# Altium schematic sheet ESenseFE-FilterBank1.SchDoc (part 2 of 2)
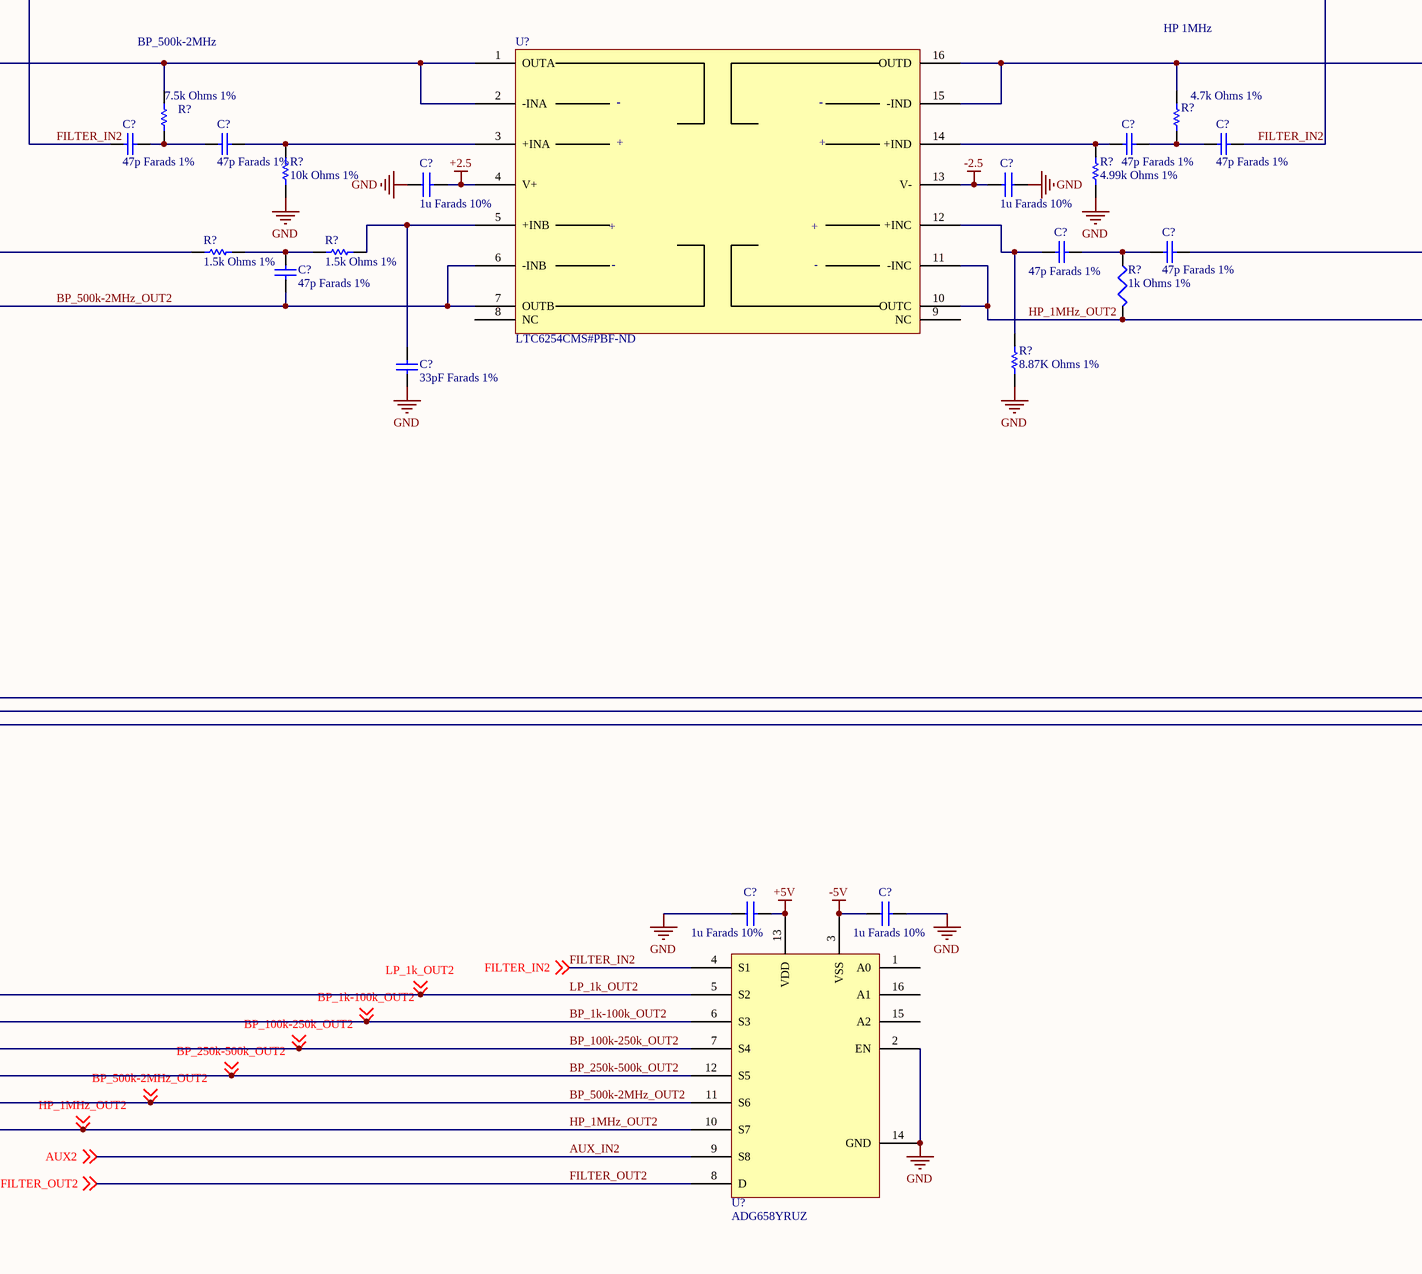
[diagram p4: ESenseFE-FilterBank1.SchDoc, bottom right]

## Library data of the parts
C?#1-C?#7 C?#10 C?#13 C?#15 = 2205: capacitor ceramic 1000pf, 50v, c0g, 0603; dielectric; mfrName: AVX; mfrPartNum: 06035A102FAT2A; Label: 1uF; Extra_Description: CAPACITOR CERAMIC 1000PF, 50V, C0G, 0603; Dielectric Characteristic:C0G/NP0; Capacitance:1000pF; Capacitance Tolerance:± 1%; Voltage Rating:50V; Temperature Coefficient:0 ± 30ppm/°C; Capacitor Case Style:0603; No. of Pins:2 ;RoHS Compliant: Yes / Packaging: ``Tape`` / RoHS: ``Compliant`` / Voltage Rating (DC): { / ``uncertainty_minus``: null, / ``value``: 50.0, / ``uncertainty_plus``: null / } / Capacitance: { / ``uncertainty_minus``: null, / ``value``: 1E-09, / ``uncertainty_plus``: null / } / Capacitance Tolerance: { / ``max_value``: 1.0, / ``max_uncertainty_plus``: null, / ``min_value``: -1.0, / ``min_uncertainty_plus``: null, / ``max_uncertainty_minus``: null / } / Number of Pins: 2; Obsolete: False; Temp_Max: 0; Type: All Parts; TypeNotes: Applies to all parts in the database; PartID: 2205; URL_Image: http://cdn.sigma.octopart.com/8893021/image/AVX-06035A102FAT2A.jpg; URL_Datasheet: http://datasheet.octopart.com/06035A102FAT2A-AVX-datasheet-8446347.pdf; Date_Created: 5/8/2011 9:06:39 AM; Date_LastModified: 5/8/2011 9:06:39 AM; Verified: False; RoHS: True; Temp_Min: 0
C?#8 C?#9 C?#11 C?#12 C?#29-C?#32 C?#49-C?#52 C?#61-C?#64 = 2065: CAP CER 1.0UF 10V 10% X5R 0603; mfrName: Murata Electronics North America; mfrPartNum: GRM188R61A105KA61D; Extra_Description: Datasheets	Chip Monolithic Ceramic Caps Part Numbering / GRM Series Spec/Test Methods (1) / GRM188R61A105KA61 / Product Photos	0603 Murata MLCC Caps / Product Training Modules	High-Cap Multilayer Ceramic Capacitors / Catalog Drawings	GRM Series Top, Sides / Standard Package	10 / Category	Capacitors / Family	Ceramic / Series	GRM / Capacitance	1.0µF / Voltage - Rated	10V / Tolerance	±10% / Temperature Coefficient	X5R / Mounting Type	Surface Mount, MLCC / Operating Temperature	-55°C ~ 85°C / Features	- / Applications	General Purpose / Ratings	- / Package / Case	0603 (1608 Metric) / Size / Dimension	0.063`` L x 0.032`` W (1.60mm x 0.80mm) / Lead Spacing	- / Thickness	0.80mm / Packaging	Cut Tape (CT) / Lead Style	- / Catalog Page	1886 (US2010 Interactive) / 1886 (US2010 PDF) / Other Names	490-1543-1; Obsolete: False; Temp_Max: 0; Type: Ceramic; PartID: 2065; URL_Image: HTTP://MEDIA.DIGIKEY.COM/PHOTOS/MURATA%20PHOTOS/0603%20MURATA%20MLCC%20CAPS.JPG; URL_Datasheet: http://search.murata.co.jp/Ceramy/image/img/w_hinm/L0005E.pdf; Date_Created: 9/27/2010 4:47:48 PM; Date_LastModified: 9/27/2010 4:47:48 PM; Verified: False; RoHS: True; Temp_Min: 0
C?#14 C?#16 C?#21-C?#28 C?#33-C?#36 C?#41-C?#48 C?#53-C?#58 = 2216: ceramic multilayer capacitor; capacitor type:general; mfrName: AVX; mfrPartNum: 06031A470FAT2A; Label: 1uF; Extra_Description: Ceramic Multilayer Capacitor; Capacitor Type:General Purpose; Capacitance:47pF; Capacitance Tolerance:± 1%; Voltage Rating:100VDC; Capacitor Dielectric Type:Multilayer Ceramic; Package/Case:0603; Termination Type:SMD ;RoHS Compliant: Yes / Mounting Type: ``Surface Mount`` / Lead-Free Status: ``Lead Free`` / Packaging: ``Cut Tape (CT)`` / RoHS: ``Compliant`` / Size-Width: { / ``uncertainty_minus``: null, / ``value``: 0.00081, / ``uncertainty_plus``: null / } / Size-Length: { / ``uncertainty_minus``: null, / ``value``: 0.0016, / ``uncertainty_plus``: null / } / Size-Height: { / ``uncertainty_minus``: null, / ``value``: 0.00086, / ``uncertainty_plus``: null / } / Voltage Rating (DC): { / ``uncertainty_minus``: null, / ``value``: 100.0, / ``uncertainty_plus``: null / } / Capacitance: { / ``uncertainty_minus``: null, / ``value``: 4.7E-11, / ``uncertainty_plus``: null / } / Capacitance Tolerance: { / ``max_value``: 1.0, / ``max_uncertainty_plus``: null, / ``min_value``: -1.0, / ``min_uncertainty_plus``: null, / ``max_uncertainty_minus``: null / } / Operating Temperature: { / ``max_value``: 125.0, / ``max_uncertainty_plus``: null, / ``min_value``: null, / ``min_uncertainty_plus``: null, / ``max_uncertainty_minus``: null / } / Number of Pins: 2; Obsolete: False; Temp_Max: 0; Type: All Parts; TypeNotes: Applies to all parts in the database; PartID: 2216; URL_Image: http://cdn.sigma.octopart.com/8893021/image/AVX-06031A470FAT2A.jpg; URL_Datasheet: http://datasheet.octopart.com/06031A470FAT2A-AVX-datasheet-118583.pdf; Date_Created: 5/9/2011 10:45:08 AM; Date_LastModified: 5/9/2011 10:45:08 AM; Verified: False; RoHS: True; Temp_Min: 0
C?#17 C?#19 = 2212: capacitor ceramic 330pf, 50v, c0g, 0603; dielectric; mfrName: AVX; mfrPartNum: 06035A331FAT2A; Label: 1uF; Extra_Description: CAPACITOR CERAMIC 330PF, 50V, C0G, 0603; Dielectric Characteristic:C0G/NP0; Capacitance:330pF; Capacitance Tolerance:± 1%; Voltage Rating:50V; Temperature Coefficient:0+/-30 ppm; Capacitor Case Style:0603; No. of Pins:2 ;RoHS Compliant: Yes / Packaging: ``Tape`` / RoHS: ``Compliant`` / Voltage Rating (DC): { / ``uncertainty_minus``: null, / ``value``: 50.0, / ``uncertainty_plus``: null / } / Capacitance: { / ``uncertainty_minus``: null, / ``value``: 3.3E-10, / ``uncertainty_plus``: null / } / Capacitance Tolerance: { / ``max_value``: 1.0, / ``max_uncertainty_plus``: null, / ``min_value``: -1.0, / ``min_uncertainty_plus``: null, / ``max_uncertainty_minus``: null / } / Number of Pins: 2; Obsolete: False; Temp_Max: 0; Type: All Parts; TypeNotes: Applies to all parts in the database; PartID: 2212; URL_Image: http://cdn.sigma.octopart.com/8893021/image/AVX-06035A331FAT2A.jpg; URL_Datasheet: http://www.avx.com/docs/Catalogs/ccog.pdf; Date_Created: 5/9/2011 10:22:55 AM; Date_LastModified: 5/9/2011 10:22:55 AM; Verified: False; RoHS: True; Temp_Min: 0
C?#18 C?#20 C?#37-C?#40 C?#59 C?#60 = 2217: ceramic multilayer capacitor; capacitor type:general; mfrName: AVX; mfrPartNum: 06031A330FAT2A; Label: 1uF; Extra_Description: Ceramic Multilayer Capacitor; Capacitor Type:General Purpose; Capacitance:33pF; Capacitance Tolerance:± 1%; Voltage Rating:100VDC; Capacitor Dielectric Type:Multilayer Ceramic; Package/Case:0603; Termination Type:SMD ;RoHS Compliant: Yes / Mounting Type: ``Surface Mount`` / Lead-Free Status: ``Lead Free`` / Packaging: ``Cut Tape (CT)`` / RoHS: ``Compliant`` / Size-Width: { / ``uncertainty_minus``: null, / ``value``: 0.00081, / ``uncertainty_plus``: null / } / Size-Length: { / ``uncertainty_minus``: null, / ``value``: 0.0016, / ``uncertainty_plus``: null / } / Size-Height: { / ``uncertainty_minus``: null, / ``value``: 0.00086, / ``uncertainty_plus``: null / } / Voltage Rating (DC): { / ``uncertainty_minus``: null, / ``value``: 100.0, / ``uncertainty_plus``: null / } / Capacitance: { / ``uncertainty_minus``: null, / ``value``: 3.3E-11, / ``uncertainty_plus``: null / } / Capacitance Tolerance: { / ``max_value``: 1.0, / ``max_uncertainty_plus``: null, / ``min_value``: -1.0, / ``min_uncertainty_plus``: null, / ``max_uncertainty_minus``: null / } / Operating Temperature: { / ``max_value``: 125.0, / ``max_uncertainty_plus``: null, / ``min_value``: null, / ``min_uncertainty_plus``: null, / ``max_uncertainty_minus``: null / } / Number of Pins: 2; Obsolete: False; Temp_Max: 0; Type: All Parts; TypeNotes: Applies to all parts in the database; PartID: 2217; URL_Image: http://cdn.sigma.octopart.com/8893021/image/AVX-06031A330FAT2A.jpg; URL_Datasheet: http://datasheet.octopart.com/06031A330FAT2A-AVX-datasheet-118583.pdf; Date_Created: 5/9/2011 10:49:16 AM; Date_LastModified: 5/9/2011 10:49:16 AM; Verified: False; RoHS: True; Temp_Min: 0
R?#1 R?#4 = 2213: rc series 0603 0.1 w 174 kohms 1% ±100 ppm/°c smt thick film; mfrName: Yageo; mfrPartNum: RC0603FR-07174KL; Value: 1K; Extra_Description: RC Series 0603 0.1 W 174 kOhms 1% ±100 ppm/°C SMT Thick Film Chip Resistor / Mounting Type: ``Surface Mount`` / Case / Package: ``0603`` / Packaging: ``Cut Tape (CT)`` / Lead-Free Status: ``Lead Free`` / RoHS: ``Compliant`` / Size-Width: { / ``uncertainty_minus``: null, / ``value``: 0.0008, / ``uncertainty_plus``: null / } / Resistance: { / ``uncertainty_minus``: null, / ``value``: 174000.0, / ``uncertainty_plus``: null / } / Size-Height: { / ``uncertainty_minus``: null, / ``value``: 0.00045, / ``uncertainty_plus``: null / } / Size-Length: { / ``uncertainty_minus``: null, / ``value``: 0.0016, / ``uncertainty_plus``: null / } / Resistance Tolerance: { / ``max_value``: 1.0, / ``max_uncertainty_plus``: null, / ``min_value``: -1.0, / ``min_uncertainty_plus``: null, / ``max_uncertainty_minus``: null / } / Operating Temperature: { / ``max_value``: 155.0, / ``max_uncertainty_plus``: null, / ``min_value``: null, / ``min_uncertainty_plus``: null, / ``max_uncertainty_minus``: null / }; Obsolete: False; Temp_Max: 0; TypeNotes: Applies to all parts in the database; Published: 8-Jun-2000; LatestRevisionDate: 17-Jul-2002; LatestRevisionNote: Re-released for DXP Platform.; PackageReference: AXIAL-0.3; Publisher: Altium Limited; PartID: 2213; URL_Image: http://cdn.sigma.octopart.com/8893411/image/Yageo-RC0603FR-07174KL.jpg; URL_Datasheet: http://datasheet.octopart.com/RC0603FR-07174KL-Yageo-datasheet-118562.pdf; Date_Created: 5/9/2011 10:33:08 AM; Date_LastModified: 5/9/2011 10:33:08 AM; Verified: False; RoHS: True; Temp_Min: 0; Type: All Parts
R?#2 R?#3 R?#5 R?#6 = 2210: res thick film 0603 1.15k ohm 1% 1/10w ?100ppm/?c molded smd; mfrName: Panasonic; mfrPartNum: ERJ-3EKF1151V; Value: 1K; Extra_Description: Res Thick Film 0603 1.15K Ohm 1% 1/10W ?100ppm/?C Molded SMD Punched Carrier T/R / Mounting Type: ``Surface Mount`` / Lead-Free Status: ``Lead Free`` / Packaging: ``Tape`` / RoHS: ``Compliant`` / Size-Width: { / ``uncertainty_minus``: null, / ``value``: 0.0008, / ``uncertainty_plus``: null / } / Resistance: { / ``uncertainty_minus``: null, / ``value``: 1150.0, / ``uncertainty_plus``: null / } / Size-Height: { / ``uncertainty_minus``: null, / ``value``: 0.00045, / ``uncertainty_plus``: null / } / Size-Length: { / ``uncertainty_minus``: null, / ``value``: 0.0016, / ``uncertainty_plus``: null / } / Resistance Tolerance: { / ``max_value``: 1.0, / ``max_uncertainty_plus``: null, / ``min_value``: -1.0, / ``min_uncertainty_plus``: null, / ``max_uncertainty_minus``: null / } / Operating Temperature: { / ``max_value``: 125.0, / ``max_uncertainty_plus``: null, / ``min_value``: null, / ``min_uncertainty_plus``: null, / ``max_uncertainty_minus``: null / }; Obsolete: False; Temp_Max: 0; TypeNotes: Applies to all parts in the database; Published: 8-Jun-2000; LatestRevisionDate: 17-Jul-2002; LatestRevisionNote: Re-released for DXP Platform.; PackageReference: AXIAL-0.3; Publisher: Altium Limited; PartID: 2210; URL_Image: http://cdn.sigma.octopart.com/8893006/image/Panasonic-ERJ-3EKF1151V.jpg; URL_Datasheet: http://industrial.panasonic.com/www-cgi/jvcr13pz.cgi?E+PZ+3+AOA0002+ERJ3EKF1153V+7+WW; Date_Created: 5/9/2011 9:45:29 AM; Date_LastModified: 5/9/2011 9:45:29 AM; Verified: False; RoHS: True; Temp_Min: 0; Type: All Parts
R?#7 R?#8 = 2214: res thick film 0603 249k ohm 1% 1/10w ?100ppm/?c molded smd; mfrName: Panasonic; mfrPartNum: ERJ-3EKF2493V; Value: 1K; Extra_Description: Res Thick Film 0603 249K Ohm 1% 1/10W |100ppm/|C SMD Punched Carrier T/R / Mounting Type: ``Surface Mount`` / Case / Package: ``0603`` / Packaging: ``Cut Tape (CT)`` / Lead-Free Status: ``Contains Lead`` / RoHS: ``Compliant`` / Size-Width: { / ``uncertainty_minus``: null, / ``value``: 0.0008, / ``uncertainty_plus``: null / } / Resistance: { / ``uncertainty_minus``: null, / ``value``: 249000.0, / ``uncertainty_plus``: null / } / Size-Height: { / ``uncertainty_minus``: null, / ``value``: 0.00045, / ``uncertainty_plus``: null / } / Size-Length: { / ``uncertainty_minus``: null, / ``value``: 0.0016, / ``uncertainty_plus``: null / } / Resistance Tolerance: { / ``max_value``: 1.0, / ``max_uncertainty_plus``: null, / ``min_value``: -1.0, / ``min_uncertainty_plus``: null, / ``max_uncertainty_minus``: null / } / Operating Temperature: { / ``max_value``: 125.0, / ``max_uncertainty_plus``: null, / ``min_value``: null, / ``min_uncertainty_plus``: null, / ``max_uncertainty_minus``: null / }; Obsolete: False; Temp_Max: 0; TypeNotes: Applies to all parts in the database; Published: 8-Jun-2000; LatestRevisionDate: 17-Jul-2002; LatestRevisionNote: Re-released for DXP Platform.; PackageReference: AXIAL-0.3; Publisher: Altium Limited; PartID: 2214; URL_Image: http://cdn.sigma.octopart.com/8893006/image/Panasonic-ERJ-3EKF2493V.jpg; URL_Datasheet: http://datasheet.octopart.com/ERJ-3EKF2493V-Panasonic-datasheet-118621.pdf; Date_Created: 5/9/2011 10:36:12 AM; Date_LastModified: 5/9/2011 10:36:12 AM; Verified: False; RoHS: True; Temp_Min: 0; Type: All Parts
R?#9-R?#12 = 2211: res 160k ohm 1/10w 1% 0603 smd; mfrName: Panasonic; mfrPartNum: ERJ-3EKF1603V; Value: 1K; Obsolete: False; Temp_Max: 0; TypeNotes: Applies to all parts in the database; Published: 8-Jun-2000; LatestRevisionDate: 17-Jul-2002; LatestRevisionNote: Re-released for DXP Platform.; PackageReference: AXIAL-0.3; Publisher: Altium Limited; PartID: 2211; Extra_Description: RES 160K OHM 1/10W 1% 0603 SMD; URL_Image: http://cdn.sigma.octopart.com/8893006/image/Panasonic-ERJ-3EKF1603V.jpg; URL_Datasheet: http://www.avx.com/docs/Catalogs/ccog.pdf; Date_Created: 5/9/2011 10:01:53 AM; Date_LastModified: 5/9/2011 10:01:53 AM; Verified: False; RoHS: True; Temp_Min: 0; Type: All Parts
R?#13-R?#16 = 2215: res thick film 0603 300k ohm 1% 1/10w ±100ppm/°c molded smd; mfrName: Panasonic; mfrPartNum: ERJ-3EKF3003V; Value: 1K; Extra_Description: Res Thick Film 0603 300K Ohm 1% 1/10W |100ppm/|C SMD Punched Carrier T/R; Obsolete: False; Temp_Max: 0; TypeNotes: Applies to all parts in the database; Published: 8-Jun-2000; LatestRevisionDate: 17-Jul-2002; LatestRevisionNote: Re-released for DXP Platform.; PackageReference: AXIAL-0.3; Publisher: Altium Limited; PartID: 2215; URL_Image: http://cdn.sigma.octopart.com/8893006/image/Panasonic-ERJ-3EKF3003V.jpg; URL_Datasheet: http://; Date_Created: 5/9/2011 10:42:57 AM; Date_LastModified: 5/9/2011 10:42:57 AM; Verified: False; RoHS: True; Temp_Min: 0; Type: All Parts
R?#17 R?#18 = 2221: resistor, thick film, 15kohm, 100mw, 1%; resistance:15kohm;; mfrName: Yageo; mfrPartNum: RC0603FR-0715KL; Value: 1K; Extra_Description: RESISTOR, THICK FILM, 15KOHM, 100mW, 1%; Resistance:15kohm; Resistance Tolerance:± 1%; Power Rating:100mW; Voltage Rating:50V; Series:RC0603; Temperature Coefficient:± 100ppm/°C; Resistor Element Material:Thick Film ;RoHS Compliant: Yes / Mounting Type: ``Surface Mount`` / Case / Package: ``0603`` / Packaging: ``Cut Tape (CT)`` / Lead-Free Status: ``Lead Free`` / RoHS: ``Compliant`` / Resistance: { / ``uncertainty_minus``: null, / ``value``: 15000.0, / ``uncertainty_plus``: null / } / Voltage Rating (DC): { / ``uncertainty_minus``: null, / ``value``: 50.0, / ``uncertainty_plus``: null / } / Size-Width: { / ``uncertainty_minus``: null, / ``value``: 0.0008, / ``uncertainty_plus``: null / } / Size-Length: { / ``uncertainty_minus``: null, / ``value``: 0.0016, / ``uncertainty_plus``: null / } / Size-Height: { / ``uncertainty_minus``: null, / ``value``: 0.00045, / ``uncertainty_plus``: null / } / Power Rating: { / ``uncertainty_minus``: null, / ``value``: 0.1, / ``uncertainty_plus``: null / } / Resistance Tolerance: { / ``max_value``: 1.0, / ``max_uncertainty_plus``: null, / ``min_value``: -1.0, / ``min_uncertainty_plus``: null, / ``max_uncertainty_minus``: null / } / Operating Temperature: { / ``max_value``: 155.0, / ``max_uncertainty_plus``: null, / ``min_value``: null, / ``min_uncertainty_plus``: null, / ``max_uncertainty_minus``: null / }; Obsolete: False; Temp_Max: 0; TypeNotes: Applies to all parts in the database; Published: 8-Jun-2000; LatestRevisionDate: 17-Jul-2002; LatestRevisionNote: Re-released for DXP Platform.; PackageReference: AXIAL-0.3; Publisher: Altium Limited; PartID: 2221; URL_Image: http://cdn.sigma.octopart.com/8893411/image/Yageo-RC0603FR-0715KL.jpg; URL_Datasheet: http://datasheet.octopart.com/RC0603FR-0715KL-Yageo-datasheet-118562.pdf; Date_Created: 5/9/2011 11:57:12 AM; Date_LastModified: 5/9/2011 11:57:12 AM; Verified: False; RoHS: True; Temp_Min: 0; Type: All Parts
R?#19 R?#20 = 2219: resistor, rc22h 0603 33k; power rating:0.1w;; mfrName: Yageo; mfrPartNum: RC0603FR-0733KL; Value: 1K; Extra_Description: RESISTOR, RC22H 0603 33K; Power Rating:0.1W; Resistance:33kohm; Resistance Tolerance:± 1%; Series:RC22H; Operating Temperature Range:-55°C to +125°C; Resistor Element Type:Thick Film; Voltage Rating:50V dc; Temperature Coefficient:± 250ppm/°C; Case Style:0603; External Length / Height:1.6mm; Temperature Coeff. -:250ppm/°C; Tempperature Coeff. +:250ppm/°C; Tolerance, +:1%; Tolerance, -:1%; Voltage Rating DC:50V; External Depth:0.45mm; External Width:0.8mm; Full Power Rating Temperature:70°C; Max Operating Temperature:125°C; Min Temperature Operating:-55°C; Reel Quantity:5000; Termination Type:SMD; Lead Spacing:0.3mm; Resistor Case Style:0603 / Mounting Type: ``Surface Mount`` / Case / Package: ``0603`` / Packaging: ``Cut Tape (CT)`` / Lead-Free Status: ``Lead Free`` / RoHS: ``Compliant`` / Resistance: { / ``uncertainty_minus``: null, / ``value``: 33000.0, / ``uncertainty_plus``: null / } / Voltage Rating (DC): { / ``uncertainty_minus``: null, / ``value``: 50.0, / ``uncertainty_plus``: null / } / Size-Width: { / ``uncertainty_minus``: null, / ``value``: 0.0008, / ``uncertainty_plus``: null / } / Size-Length: { / ``uncertainty_minus``: null, / ``value``: 0.0016, / ``uncertainty_plus``: null / } / Size-Height: { / ``uncertainty_minus``: null, / ``value``: 0.00045, / ``uncertainty_plus``: null / } / Power Rating: { / ``uncertainty_minus``: null, / ``value``: 0.1, / ``uncertainty_plus``: null / } / Resistance Tolerance: { / ``max_value``: 1.0, / ``max_uncertainty_plus``: null, / ``min_value``: -1.0, / ``min_uncertainty_plus``: null, / ``max_uncertainty_minus``: null / } / Operating Temperature: { / ``max_value``: 155.0, / ``max_uncertainty_plus``: null, / ``min_value``: null, / ``min_uncertainty_plus``: null, / ``max_uncertainty_minus``: null / } / Number of Pins: 2; Obsolete: False; Temp_Max: 0; TypeNotes: Applies to all parts in the database; Published: 8-Jun-2000; LatestRevisionDate: 17-Jul-2002; LatestRevisionNote: Re-released for DXP Platform.; PackageReference: AXIAL-0.3; Publisher: Altium Limited; PartID: 2219; URL_Image: http://cdn.sigma.octopart.com/8893411/image/Yageo-RC0603FR-0733KL.jpg; URL_Datasheet: http://datasheet.octopart.com/RC0603FR-0733KL-Yageo-datasheet-118562.pdf; Date_Created: 5/9/2011 11:31:23 AM; Date_LastModified: 5/9/2011 11:31:23 AM; Verified: False; RoHS: True; Temp_Min: 0; Type: All Parts
R?#21 R?#23 = 2218: res thick film 0603 49.9k ohm 1% 1/10w ±100ppm/°c molded smd; mfrName: Panasonic; mfrPartNum: ERJ-3EKF4992V; Value: 1K; Extra_Description: Res Thick Film 0603 49.9K Ohm 1% 1/10W ±100ppm/°C Molded SMD Punched Carrier T/R / Mounting Type: ``Surface Mount`` / Case / Package: ``0603`` / Packaging: ``Cut Tape (CT)`` / Lead-Free Status: ``Lead Free`` / RoHS: ``Compliant`` / Size-Width: { / ``uncertainty_minus``: null, / ``value``: 0.0008, / ``uncertainty_plus``: null / } / Resistance: { / ``uncertainty_minus``: null, / ``value``: 49900.0, / ``uncertainty_plus``: null / } / Size-Height: { / ``uncertainty_minus``: null, / ``value``: 0.00045, / ``uncertainty_plus``: null / } / Size-Length: { / ``uncertainty_minus``: null, / ``value``: 0.0016, / ``uncertainty_plus``: null / } / Resistance Tolerance: { / ``max_value``: 1.0, / ``max_uncertainty_plus``: null, / ``min_value``: -1.0, / ``min_uncertainty_plus``: null, / ``max_uncertainty_minus``: null / } / Operating Temperature: { / ``max_value``: 125.0, / ``max_uncertainty_plus``: null, / ``min_value``: null, / ``min_uncertainty_plus``: null, / ``max_uncertainty_minus``: null / }; Obsolete: False; Temp_Max: 0; TypeNotes: Applies to all parts in the database; Published: 8-Jun-2000; LatestRevisionDate: 17-Jul-2002; LatestRevisionNote: Re-released for DXP Platform.; PackageReference: AXIAL-0.3; Publisher: Altium Limited; PartID: 2218; URL_Image: http://cdn.sigma.octopart.com/8893006/image/Panasonic-ERJ-3EKF4992V.jpg; URL_Datasheet: http://datasheet.octopart.com/ERJ-3EKF4992V-Panasonic-datasheet-118621.pdf; Date_Created: 5/9/2011 11:28:00 AM; Date_LastModified: 5/9/2011 11:28:00 AM; Verified: False; RoHS: True; Temp_Min: 0; Type: All Parts
R?#22 R?#24 = 2222: res thick film 0603 20k ohm 1% 1/10w ?100ppm/?c molded smd; mfrName: Panasonic; mfrPartNum: ERJ-3EKF2002V; Value: 1K; Extra_Description: Res Thick Film 0603 20K Ohm 1% 1/10W ?100ppm/?C Molded SMD Punched Carrier T/R / Mounting Type: ``Surface Mount`` / Case / Package: ``0603`` / Packaging: ``Cut Tape (CT)`` / Lead-Free Status: ``Lead Free`` / RoHS: ``Compliant`` / Size-Width: { / ``uncertainty_minus``: null, / ``value``: 0.0008, / ``uncertainty_plus``: null / } / Resistance: { / ``uncertainty_minus``: null, / ``value``: 20000.0, / ``uncertainty_plus``: null / } / Size-Height: { / ``uncertainty_minus``: null, / ``value``: 0.00045, / ``uncertainty_plus``: null / } / Size-Length: { / ``uncertainty_minus``: null, / ``value``: 0.0016, / ``uncertainty_plus``: null / } / Resistance Tolerance: { / ``max_value``: 1.0, / ``max_uncertainty_plus``: null, / ``min_value``: -1.0, / ``min_uncertainty_plus``: null, / ``max_uncertainty_minus``: null / } / Operating Temperature: { / ``max_value``: 125.0, / ``max_uncertainty_plus``: null, / ``min_value``: null, / ``min_uncertainty_plus``: null, / ``max_uncertainty_minus``: null / }; Obsolete: False; Temp_Max: 0; TypeNotes: Applies to all parts in the database; Published: 8-Jun-2000; LatestRevisionDate: 17-Jul-2002; LatestRevisionNote: Re-released for DXP Platform.; PackageReference: AXIAL-0.3; Publisher: Altium Limited; PartID: 2222; URL_Image: http://cdn.sigma.octopart.com/8893006/image/Panasonic-ERJ-3EKF2002V.jpg; URL_Datasheet: http://datasheet.octopart.com/ERJ-3EKF2002V-Panasonic-datasheet-118621.pdf; Date_Created: 5/9/2011 12:31:38 PM; Date_LastModified: 5/9/2011 12:31:38 PM; Verified: False; RoHS: True; Temp_Min: 0; Type: All Parts
R?#25 R?#26 R?#29 R?#30 = 2220: resistor, rc22h 0603 12k; resistance:12kohm; resistance; mfrName: Yageo; mfrPartNum: RC0603FR-0712KL; Value: 1K; Extra_Description: RESISTOR, RC22H 0603 12K; Resistance:12kohm; Resistance Tolerance:± 1%; Power Rating:0.1W; Voltage Rating:50V dc; Series:RC22H; Temperature Coefficient:± 250ppm/°C; Resistor Element Type:Thick Film; Resistor Case Style:0603; No. of Pins:2; SVHC:No SVHC; Case Style:0603; External Length / Height:1.6mm; Temperature Coeff. +:250ppm/°C; Temperature Coeff. -:250ppm/°C; Tolerance, +:1%; Tolerance, -:1%; Voltage Rating DC:50V; External Depth:0.45mm; External Width:0.8mm; Full Power Rating Temperature:70°C; Max Operating Temperature:125°C; Min Temperature Operating:-55°C; Operating Temperature Range:-55°C to +125°C; Reel Quantity:5000; Termination Type:SMD; Lead Spacing:0.3mm / Mounting Type: ``Surface Mount`` / Case / Package: ``0603`` / Packaging: ``Cut Tape (CT)`` / Lead-Free Status: ``Lead Free`` / RoHS: ``Compliant`` / Resistance: { / ``uncertainty_minus``: null, / ``value``: 12000.0, / ``uncertainty_plus``: null / } / Voltage Rating (DC): { / ``uncertainty_minus``: null, / ``value``: 50.0, / ``uncertainty_plus``: null / } / Size-Width: { / ``uncertainty_minus``: null, / ``value``: 0.0008, / ``uncertainty_plus``: null / } / Size-Length: { / ``uncertainty_minus``: null, / ``value``: 0.0016, / ``uncertainty_plus``: null / } / Size-Height: { / ``uncertainty_minus``: null, / ``value``: 0.00045, / ``uncertainty_plus``: null / } / Power Rating: { / ``uncertainty_minus``: null, / ``value``: 0.1, / ``uncertainty_plus``: null / } / Resistance Tolerance: { / ``max_value``: 1.0, / ``max_uncertainty_plus``: null, / ``min_value``: -1.0, / ``min_uncertainty_plus``: null, / ``max_uncertainty_minus``: null / } / Operating Temperature: { / ``max_value``: 155.0, / ``max_uncertainty_plus``: null, / ``min_value``: null, / ``min_uncertainty_plus``: null, / ``max_uncertainty_minus``: null / } / Number of Pins: 2; Obsolete: False; Temp_Max: 0; TypeNotes: Applies to all parts in the database; Published: 8-Jun-2000; LatestRevisionDate: 17-Jul-2002; LatestRevisionNote: Re-released for DXP Platform.; PackageReference: AXIAL-0.3; Publisher: Altium Limited; PartID: 2220; URL_Image: http://cdn.sigma.octopart.com/8893411/image/Yageo-RC0603FR-0712KL.jpg; URL_Datasheet: http://datasheet.octopart.com/RC0603FR-0712KL-Yageo-datasheet-118562.pdf; Date_Created: 5/9/2011 11:39:05 AM; Date_LastModified: 5/9/2011 11:39:05 AM; Verified: False; RoHS: True; Temp_Min: 0; Type: All Parts
R?#27 R?#28 R?#31 R?#32 = 2223: res thick film 0603 6.19k ohm 1% 1/10w ±100ppm/°c smd; mfrName: Panasonic; mfrPartNum: ERJ-3EKF6191V; Value: 1K; Extra_Description: Res Thick Film 0603 6.19K Ohm 1% 1/10W ±100ppm/°C SMD Punched Carrier T/R / Mounting Type: ``Surface Mount`` / Case / Package: ``0603`` / Packaging: ``Cut Tape (CT)`` / Lead-Free Status: ``Lead Free`` / RoHS: ``Compliant`` / Size-Width: { / ``uncertainty_minus``: null, / ``value``: 0.0008, / ``uncertainty_plus``: null / } / Resistance: { / ``uncertainty_minus``: null, / ``value``: 6190.0, / ``uncertainty_plus``: null / } / Size-Height: { / ``uncertainty_minus``: null, / ``value``: 0.00045, / ``uncertainty_plus``: null / } / Size-Length: { / ``uncertainty_minus``: null, / ``value``: 0.0016, / ``uncertainty_plus``: null / } / Resistance Tolerance: { / ``max_value``: 1.0, / ``max_uncertainty_plus``: null, / ``min_value``: -1.0, / ``min_uncertainty_plus``: null, / ``max_uncertainty_minus``: null / } / Operating Temperature: { / ``max_value``: 125.0, / ``max_uncertainty_plus``: null, / ``min_value``: null, / ``min_uncertainty_plus``: null, / ``max_uncertainty_minus``: null / }; Obsolete: False; Temp_Max: 0; TypeNotes: Applies to all parts in the database; Published: 8-Jun-2000; LatestRevisionDate: 17-Jul-2002; LatestRevisionNote: Re-released for DXP Platform.; PackageReference: AXIAL-0.3; Publisher: Altium Limited; PartID: 2223; URL_Image: http://cdn.sigma.octopart.com/8893006/image/Panasonic-ERJ-3EKF6191V.jpg; URL_Datasheet: http://datasheet.octopart.com/ERJ-3EKF6191V-Panasonic-datasheet-118621.pdf; Date_Created: 5/9/2011 12:36:24 PM; Date_LastModified: 5/9/2011 12:36:24 PM; Verified: False; RoHS: True; Temp_Min: 0; Type: All Parts
R?#33 R?#35 = 2224: res thick film 0603 7.5k ohm 1% 1/10w ±100ppm/°c molded smd; mfrName: Panasonic; mfrPartNum: ERJ-3EKF7501V; Value: 1K; Extra_Description: Res Thick Film 0603 7.5K Ohm 1% 1/10W ±100ppm/°C Molded SMD Punched Carrier T/R / Mounting Type: ``Surface Mount`` / Case / Package: ``0603`` / Packaging: ``Cut Tape (CT)`` / Lead-Free Status: ``Lead Free`` / RoHS: ``Compliant`` / Size-Width: { / ``uncertainty_minus``: null, / ``value``: 0.0008, / ``uncertainty_plus``: null / } / Resistance: { / ``uncertainty_minus``: null, / ``value``: 7500.0, / ``uncertainty_plus``: null / } / Size-Height: { / ``uncertainty_minus``: null, / ``value``: 0.00045, / ``uncertainty_plus``: null / } / Size-Length: { / ``uncertainty_minus``: null, / ``value``: 0.0016, / ``uncertainty_plus``: null / } / Resistance Tolerance: { / ``max_value``: 1.0, / ``max_uncertainty_plus``: null, / ``min_value``: -1.0, / ``min_uncertainty_plus``: null, / ``max_uncertainty_minus``: null / } / Operating Temperature: { / ``max_value``: 125.0, / ``max_uncertainty_plus``: null, / ``min_value``: null, / ``min_uncertainty_plus``: null, / ``max_uncertainty_minus``: null / }; Obsolete: False; Temp_Max: 0; TypeNotes: Applies to all parts in the database; Published: 8-Jun-2000; LatestRevisionDate: 17-Jul-2002; LatestRevisionNote: Re-released for DXP Platform.; PackageReference: AXIAL-0.3; Publisher: Altium Limited; PartID: 2224; URL_Image: http://cdn.sigma.octopart.com/8893006/image/Panasonic-ERJ-3EKF7501V.jpg; URL_Datasheet: http://datasheet.octopart.com/ERJ-3EKF7501V-Panasonic-datasheet-118621.pdf; Date_Created: 5/9/2011 1:02:12 PM; Date_LastModified: 5/9/2011 1:02:12 PM; Verified: False; RoHS: True; Temp_Min: 0; Type: All Parts
R?#34 R?#36 = 2227: resistor, rc22h 0603 470k; power rating:0.1w;; mfrName: Yageo; mfrPartNum: RC0603FR-07470KL; Value: 1K; Extra_Description: RESISTOR, RC22H 0603 470K; Power Rating:0.1W; Resistance:470kohm; Resistance Tolerance:± 1%; Series:RC22H; Operating Temperature Range:-55°C to +125°C; Resistor Element Type:Thick Film; Voltage Rating:50V dc; Temperature Coefficient:± 250ppm/°C; Case Style:0603; External Length / Height:1.6mm; Temperature Coeff. -:250ppm/°C; Tempperature Coeff. +:250ppm/°C; Tolerance, +:1%; Tolerance, -:1%; Voltage Rating DC:50V; External Depth:0.45mm; External Width:0.8mm; Full Power Rating Temperature:70°C; Max Operating Temperature:125°C; Min Temperature Operating:-55°C; Reel Quantity:5000; Termination Type:SMD; Lead Spacing:0.3mm; Resistor Case Style:0603 / Mounting Type: ``Surface Mount`` / Case / Package: ``0603`` / Packaging: ``Cut Tape (CT)`` / Lead-Free Status: ``Lead Free`` / RoHS: ``Compliant`` / Resistance: { / ``uncertainty_minus``: null, / ``value``: 470000.0, / ``uncertainty_plus``: null / } / Voltage Rating (DC): { / ``uncertainty_minus``: null, / ``value``: 50.0, / ``uncertainty_plus``: null / } / Size-Width: { / ``uncertainty_minus``: null, / ``value``: 0.0008, / ``uncertainty_plus``: null / } / Size-Length: { / ``uncertainty_minus``: null, / ``value``: 0.0016, / ``uncertainty_plus``: null / } / Size-Height: { / ``uncertainty_minus``: null, / ``value``: 0.00045, / ``uncertainty_plus``: null / } / Power Rating: { / ``uncertainty_minus``: null, / ``value``: 0.1, / ``uncertainty_plus``: null / } / Resistance Tolerance: { / ``max_value``: 1.0, / ``max_uncertainty_plus``: null, / ``min_value``: -1.0, / ``min_uncertainty_plus``: null, / ``max_uncertainty_minus``: null / } / Operating Temperature: { / ``max_value``: 155.0, / ``max_uncertainty_plus``: null, / ``min_value``: null, / ``min_uncertainty_plus``: null, / ``max_uncertainty_minus``: null / } / Number of Pins: 2; Obsolete: False; Temp_Max: 0; TypeNotes: Applies to all parts in the database; Published: 8-Jun-2000; LatestRevisionDate: 17-Jul-2002; LatestRevisionNote: Re-released for DXP Platform.; PackageReference: AXIAL-0.3; Publisher: Altium Limited; PartID: 2227; URL_Image: http://cdn.sigma.octopart.com/5320740/image/Yageo-RC0603FR-07470KL.jpg; URL_Datasheet: http://datasheet.octopart.com/RC0603FR-07470KL-Yageo-datasheet-118562.pdf; Date_Created: 5/9/2011 1:29:50 PM; Date_LastModified: 5/9/2011 1:29:50 PM; Verified: False; RoHS: True; Temp_Min: 0; Type: All Parts
R?#37 R?#39 = 2225: resistor, rc22h 0603 1k; power rating:0.1w;; mfrName: Yageo; mfrPartNum: RC0603FR-071KL; Extra_Description: RESISTOR, RC22H 0603 1K; Power Rating:0.1W; Resistance:1kohm; Resistance Tolerance:± 1%; Series:RC22H; Operating Temperature Range:-55°C to +125°C; Resistor Element Type:Thick Film; Voltage Rating:50V dc; Temperature Coefficient:± 250ppm/°C; Case Style:0603; External Length / Height:1.6mm; Temperature Coeff. -:250ppm/°C; Tempperature Coeff. +:250ppm/°C; Tolerance, +:1%; Tolerance, -:1%; Voltage Rating DC:50V; External Depth:0.45mm; External Width:0.8mm; Full Power Rating Temperature:70°C; Max Operating Temperature:125°C; Min Temperature Operating:-55°C; Reel Quantity:5000; Termination Type:SMD; Lead Spacing:0.3mm / Mounting Type: ``Surface Mount`` / Case / Package: ``0603`` / Packaging: ``Cut Tape (CT)`` / Lead-Free Status: ``Lead Free`` / RoHS: ``Compliant`` / Resistance: { / ``uncertainty_minus``: null, / ``value``: 1000.0, / ``uncertainty_plus``: null / } / Voltage Rating (DC): { / ``uncertainty_minus``: null, / ``value``: 50.0, / ``uncertainty_plus``: null / } / Size-Width: { / ``uncertainty_minus``: null, / ``value``: 0.0008, / ``uncertainty_plus``: null / } / Size-Length: { / ``uncertainty_minus``: null, / ``value``: 0.0016, / ``uncertainty_plus``: null / } / Size-Height: { / ``uncertainty_minus``: null, / ``value``: 0.00045, / ``uncertainty_plus``: null / } / Power Rating: { / ``uncertainty_minus``: null, / ``value``: 0.1, / ``uncertainty_plus``: null / } / Resistance Tolerance: { / ``max_value``: 1.0, / ``max_uncertainty_plus``: null, / ``min_value``: -1.0, / ``min_uncertainty_plus``: null, / ``max_uncertainty_minus``: null / } / Operating Temperature: { / ``max_value``: 155.0, / ``max_uncertainty_plus``: null, / ``min_value``: null, / ``min_uncertainty_plus``: null, / ``max_uncertainty_minus``: null / } / Number of Pins: 2; Obsolete: False; Temp_Max: 0; TypeNotes: Applies to all parts in the database; Published: 8-Jun-2000; LatestRevisionDate: 17-Jul-2002; LatestRevisionNote: Re-released for DXP Platform.; PackageReference: AXIAL-0.3; Publisher: Altium Limited; Value: 1K; PartID: 2225; URL_Image: http://cdn.sigma.octopart.com/500295/image/Yageo-RC0603FR-071KL.jpg; URL_Datasheet: http://datasheet.octopart.com/RC0603FR-071KL-Yageo-datasheet-118562.pdf; Date_Created: 5/9/2011 1:04:59 PM; Date_LastModified: 5/9/2011 1:04:59 PM; Verified: False; RoHS: True; Temp_Min: 0; Type: All Parts
R?#38 R?#40 = 2228: res thick film 0603 4.99k ohm 1% 1/10w ±100ppm/°c smd; mfrName: Panasonic; mfrPartNum: ERJ-3EKF4991V; Value: 1K; Extra_Description: RES 4.99K OHM 1/10W 1% 0603 SMD / Mounting Type: ``Surface Mount`` / Case / Package: ``0603`` / Packaging: ``Cut Tape (CT)`` / Lead-Free Status: ``Contains Lead`` / RoHS: ``Non-Compliant`` / Size-Width: { / ``uncertainty_minus``: null, / ``value``: 0.0008, / ``uncertainty_plus``: null / } / Resistance: { / ``uncertainty_minus``: null, / ``value``: 4990.0, / ``uncertainty_plus``: null / } / Size-Height: { / ``uncertainty_minus``: null, / ``value``: 0.00045, / ``uncertainty_plus``: null / } / Size-Length: { / ``uncertainty_minus``: null, / ``value``: 0.0016, / ``uncertainty_plus``: null / } / Resistance Tolerance: { / ``max_value``: 1.0, / ``max_uncertainty_plus``: null, / ``min_value``: -1.0, / ``min_uncertainty_plus``: null, / ``max_uncertainty_minus``: null / } / Operating Temperature: { / ``max_value``: 125.0, / ``max_uncertainty_plus``: null, / ``min_value``: null, / ``min_uncertainty_plus``: null, / ``max_uncertainty_minus``: null / }; Obsolete: False; Temp_Max: 0; TypeNotes: Applies to all parts in the database; Published: 8-Jun-2000; LatestRevisionDate: 17-Jul-2002; LatestRevisionNote: Re-released for DXP Platform.; PackageReference: AXIAL-0.3; Publisher: Altium Limited; PartID: 2228; URL_Image: http://cdn.sigma.octopart.com/8893006/image/Panasonic-ERJ-3EKF4991V.jpg; URL_Datasheet: http://datasheet.octopart.com/ERJ-3EKF4991V-Panasonic-datasheet-118621.pdf; Date_Created: 5/9/2011 1:33:57 PM; Date_LastModified: 5/9/2011 1:33:57 PM; Verified: False; RoHS: True; Temp_Min: 0; Type: All Parts
R?#41-R?#44 = 2226: resistor, rc22h 0603 1k5; power rating:0.1w;; mfrName: Yageo; mfrPartNum: RC0603FR-071K5L; Value: 1K; Extra_Description: RESISTOR, RC22H 0603 1K5; Power Rating:0.1W; Resistance:1.5kohm; Resistance Tolerance:± 1%; Series:RC22H; Operating Temperature Range:-55°C to +125°C; Resistor Element Type:Thick Film; Voltage Rating:50V dc; Temperature Coefficient:± 250ppm/°C; Case Style:0603; External Length / Height:1.6mm; Temperature Coeff. -:250ppm/°C; Tempperature Coeff. +:250ppm/°C; Tolerance, +:1%; Tolerance, -:1%; Voltage Rating DC:50V; External Depth:0.45mm; External Width:0.8mm; Full Power Rating Temperature:70°C; Max Operating Temperature:125°C; Min Temperature Operating:-55°C; Reel Quantity:5000; Termination Type:SMD; Lead Spacing:0.3mm; Resistor Case Style:0603 / Mounting Type: ``Surface Mount`` / Case / Package: ``0603`` / Packaging: ``Cut Tape (CT)`` / Lead-Free Status: ``Lead Free`` / RoHS: ``Compliant`` / Resistance: { / ``uncertainty_minus``: null, / ``value``: 1500.0, / ``uncertainty_plus``: null / } / Voltage Rating (DC): { / ``uncertainty_minus``: null, / ``value``: 50.0, / ``uncertainty_plus``: null / } / Size-Width: { / ``uncertainty_minus``: null, / ``value``: 0.0008, / ``uncertainty_plus``: null / } / Size-Length: { / ``uncertainty_minus``: null, / ``value``: 0.0016, / ``uncertainty_plus``: null / } / Size-Height: { / ``uncertainty_minus``: null, / ``value``: 0.00045, / ``uncertainty_plus``: null / } / Power Rating: { / ``uncertainty_minus``: null, / ``value``: 0.1, / ``uncertainty_plus``: null / } / Resistance Tolerance: { / ``max_value``: 1.0, / ``max_uncertainty_plus``: null, / ``min_value``: -1.0, / ``min_uncertainty_plus``: null, / ``max_uncertainty_minus``: null / } / Operating Temperature: { / ``max_value``: 155.0, / ``max_uncertainty_plus``: null, / ``min_value``: null, / ``min_uncertainty_plus``: null, / ``max_uncertainty_minus``: null / } / Number of Pins: 2; Obsolete: False; Temp_Max: 0; TypeNotes: Applies to all parts in the database; Published: 8-Jun-2000; LatestRevisionDate: 17-Jul-2002; LatestRevisionNote: Re-released for DXP Platform.; PackageReference: AXIAL-0.3; Publisher: Altium Limited; PartID: 2226; URL_Image: http://cdn.sigma.octopart.com/5320740/image/Yageo-RC0603FR-071K5L.jpg; URL_Datasheet: http://datasheet.octopart.com/RC0603FR-071K5L-Yageo-datasheet-8328172.pdf; Date_Created: 5/9/2011 1:11:38 PM; Date_LastModified: 5/9/2011 1:11:38 PM; Verified: False; RoHS: True; Temp_Min: 0; Type: All Parts
R?#45 R?#46 = 2043: RES 1.00K OHM 1/10W 1% 0603 SMD; mfrName: Panasonic - ECG; mfrPartNum: ERJ-3EKF1001V; Extra_Description: Datasheets	ERJ-3EKF1001V View All Specifications / Product Photos	0603 Pkg / Catalog Drawings	1% Thick Film Chip Material / 1% Thick Film Chip / Standard Package	200 / Category	Resistors / Family	Chip Resistor - Surface Mount / Series	ERJ / Resistance In Ohms	1.00K / Power (Watts)	0.1W, 1/10W / Composition	Thick Film / Features	- / Temperature Coefficient	±100ppm/°C / Tolerance	±1% / Case	0603 (1608 metric) / Size / Dimension	0.063`` L x 0.031`` W (1.60mm x 0.80mm) / Height	0.018`` (0.45mm) / Lead Style	Surface Mount (SMD - SMT) / Packaging	Cut Tape (CT) / Catalog Page	1954 (US2010 Interactive) / 1954 (US2010 PDF) / Kits	RSM3H-ND - KIT CHIP RES 96 VALUES 50EA 0603 / Other Names	ERJ-3EKF1001 / ERJ3EKF1001 / P1.00KHCT; Obsolete: False; Temp_Max: 0; PartID: 2043; URL_Image: http://media.digikey.com/photos/Panasonic%20Photos/10-0603%20Resistor.jpg?cshift_ck=null&client_id=5042; URL_Datasheet: http://industrial.panasonic.com/www-cgi/jvcr13pz.cgi?E+PZ+3+AOA0002+ERJ3EKF1001V+7+WW; Date_Created: 9/14/2010 11:34:31 AM; Date_LastModified: 9/14/2010 11:34:31 AM; Verified: False; RoHS: True; Temp_Min: 0; Type: Chip Resistor - Surface Mount
R?#47 R?#48 = 2229: res thick film 0603 8.87k ohm 1% 1/10w ±100ppm/°c molded smd; mfrName: Panasonic; mfrPartNum: ERJ-3EKF8871V; Value: 1K; Extra_Description: RES 8.87K OHM 1/10W 1% 0603 SMD / Mounting Type: ``Surface Mount`` / Case / Package: ``0603`` / Packaging: ``Cut Tape (CT)`` / Lead-Free Status: ``Lead Free`` / RoHS: ``Compliant`` / Size-Width: { / ``uncertainty_minus``: null, / ``value``: 0.0008, / ``uncertainty_plus``: null / } / Resistance: { / ``uncertainty_minus``: null, / ``value``: 8870.0, / ``uncertainty_plus``: null / } / Size-Height: { / ``uncertainty_minus``: null, / ``value``: 0.00045, / ``uncertainty_plus``: null / } / Size-Length: { / ``uncertainty_minus``: null, / ``value``: 0.0016, / ``uncertainty_plus``: null / } / Resistance Tolerance: { / ``max_value``: 1.0, / ``max_uncertainty_plus``: null, / ``min_value``: -1.0, / ``min_uncertainty_plus``: null, / ``max_uncertainty_minus``: null / } / Operating Temperature: { / ``max_value``: 125.0, / ``max_uncertainty_plus``: null, / ``min_value``: null, / ``min_uncertainty_plus``: null, / ``max_uncertainty_minus``: null / }; Obsolete: False; Temp_Max: 0; TypeNotes: Applies to all parts in the database; Published: 8-Jun-2000; LatestRevisionDate: 17-Jul-2002; LatestRevisionNote: Re-released for DXP Platform.; PackageReference: AXIAL-0.3; Publisher: Altium Limited; PartID: 2229; URL_Image: http://cdn.sigma.octopart.com/8893006/image/Panasonic-ERJ-3EKF8871V.jpg; URL_Datasheet: http://datasheet.octopart.com/ERJ-3EKF8871V-Panasonic-datasheet-118621.pdf; Date_Created: 5/9/2011 1:40:01 PM; Date_LastModified: 5/9/2011 1:40:01 PM; Verified: False; RoHS: True; Temp_Min: 0; Type: All Parts
U?#1-U?#6 = 2191: op amp, dual, r-r, 180mhz, 8msop; op amp type:unity gain; mfrName: Linear Technology; Extra_Description: OP AMP, DUAL, R-R, 180MHZ, 8MSOP; Op Amp Type:Unity Gain Stable; No. of Amplifiers:2; Bandwidth:180MHz; Slew Rate:90V/µs; Supply Voltage Range:2.5V to 5.25V; Amplifier Case Style:MSOP; No. of Pins:8; SVHC:No SVHC (15-Dec-2010); Base Number:6247; Operating Temperature Range:0°C to +70°C / RoHS: ``Compliant`` / Slew Rate: { / ``uncertainty_minus``: null, / ``value``: 90.0, / ``uncertainty_plus``: null / } / Number of Pins: 8; Obsolete: False; Temp_Max: 0; TypeNotes: Applies to all parts in the database; PartID: 2191; mfrPartNum: LTC6254CMS#PBF-ND; URL_Image: http://cds.linear.com/images/product/4358_pack_3.jpg; URL_Datasheet: http://datasheet.octopart.com/LTC6247CMS8%23PBF-Linear-Technology-datasheet-8712476.pdf; Date_Created: 5/5/2011 9:52:24 AM; Date_LastModified: 5/5/2011 9:52:24 AM; Verified: False; RoHS: True; Temp_Min: 0; Type: All Parts
U?#7 U?#8 = 2230: mux, 8-ch, smd, tssop16, 658; analogue multiplexer; mfrName: Analog Devices; Extra_Description: IC, ANALOG MULTIPLEXER, 8 X 1, TSSOP-16; On State Resistance Max:45ohm; Operating Temperature Range:-40°C to +125°C; Analog Switch Case Style:TSSOP; No. of Pins:16; Multiplexer Configuration:8:1; Package/Case:16-TSSOP ;RoHS Compliant: Yes / Mounting Type: ``Surface Mount`` / Case / Package: ``TSSOP-16`` / Packaging: ``Bulk`` / Lead-Free Status: ``Lead Free`` / RoHS: ``Compliant`` / Rds [Drain to Source Resistance] (on): { / ``uncertainty_minus``: null, / ``value``: 45.0, / ``uncertainty_plus``: null / } / Operating Temperature: { / ``max_value``: 125.0, / ``max_uncertainty_plus``: null, / ``min_value``: null, / ``min_uncertainty_plus``: null, / ``max_uncertainty_minus``: null / } / Supply Voltage (DC): { / ``max_value``: 12.0, / ``max_uncertainty_plus``: null, / ``min_value``: null, / ``min_uncertainty_plus``: null, / ``max_uncertainty_minus``: null / } / Number of Channels: 8 / Number of Circuits: 1 / Number of Pins: 16; Obsolete: False; Temp_Max: 0; TypeNotes: Applies to all parts in the database; PartID: 2230; mfrPartNum: ADG658YRUZ; URL_Image: http://cdn.sigma.octopart.com/8892481/image/Analog-Devices-ADG658YRUZ.jpg; URL_Datasheet: http://datasheet.octopart.com/ADG658YRUZ-Analog-Devices-datasheet-7606323.pdf; Date_Created: 5/13/2011 5:38:05 AM; Date_LastModified: 5/13/2011 5:38:05 AM; Verified: False; RoHS: True; Temp_Min: 0; Type: All Parts